# Altium schematic sheet Input_signals.SchDoc
size A4; Author: Luis Henrique DAvila Possatti; Organization: University of Campinas
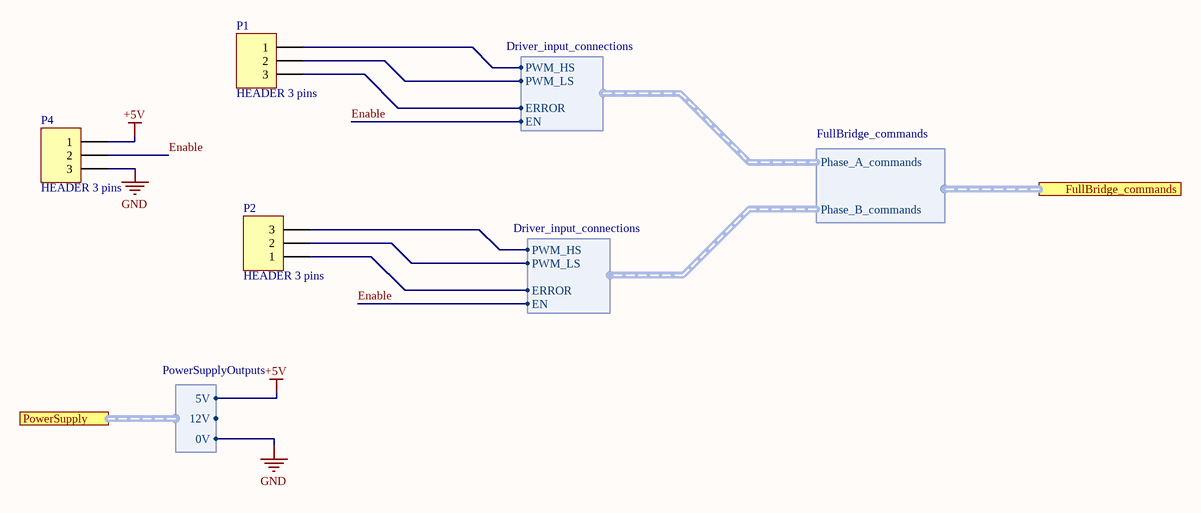
[diagram p0: Input_signals.SchDoc]

## Parts
P1  HEADER 3 pins  [HDR1X3]
P2  HEADER 3 pins  [HDR1X3]
P4  HEADER 3 pins  [HDR1X3 - Jumper]

## Ports
FullBridge_commands (harness FullBridge_commands), PowerSupply (harness PowerSupplyOutputs)

## Harnesses
Driver_input_connections: EN, ERROR, PWM_HS, PWM_LS
FullBridge_commands: Phase_A_commands, Phase_B_commands
PowerSupplyOutputs: 0V, 12V, 5V

## Nets
+5V: P4.1 ; port PowerSupply.5V
GND: P4.3 ; port PowerSupply.0V
Enable: P4.2 ; harness Driver_input_connections.EN
NetP1_1: P1.1 ; harness Driver_input_connections.PWM_HS
NetP1_2: P1.2 ; harness Driver_input_connections.PWM_LS
NetP1_3: P1.3 ; harness Driver_input_connections.ERROR
NetP2_1: P2.1 ; harness Driver_input_connections.ERROR
NetP2_2: P2.2 ; harness Driver_input_connections.PWM_LS
NetP2_3: P2.3 ; harness Driver_input_connections.PWM_HS

## Notes on the sheet
- Title
- Size:
- Date:
- A4
- Number:
- Time:
- Revision:
- Sheet
- of
- Author
- Organization
- File:

## Library data of the parts
P1 = HEADER 3 pins: Header 2.54mm 3 pins; Pin_3_signal: HS_in; Pin_2_signal: LS_in; Pin_1_signal: Error_out; jumper_message: Side A signals; PN: ?
P2 = HEADER 3 pins: Header 2.54mm 3 pins; Pin_3_signal: HS_in; Pin_2_signal: LS_in; Pin_1_signal: Error_out; jumper_message: Side B signals; PN: ?
P4 = HEADER 3 pins: Header 2.54mm 3 pins; Pin_3_signal: GND; Pin_2_signal: Enable; Pin_1_signal: +5V; jumper_message: Select enable; PN: ?